# Altium schematic sheet Pic32.SchDoc
size A
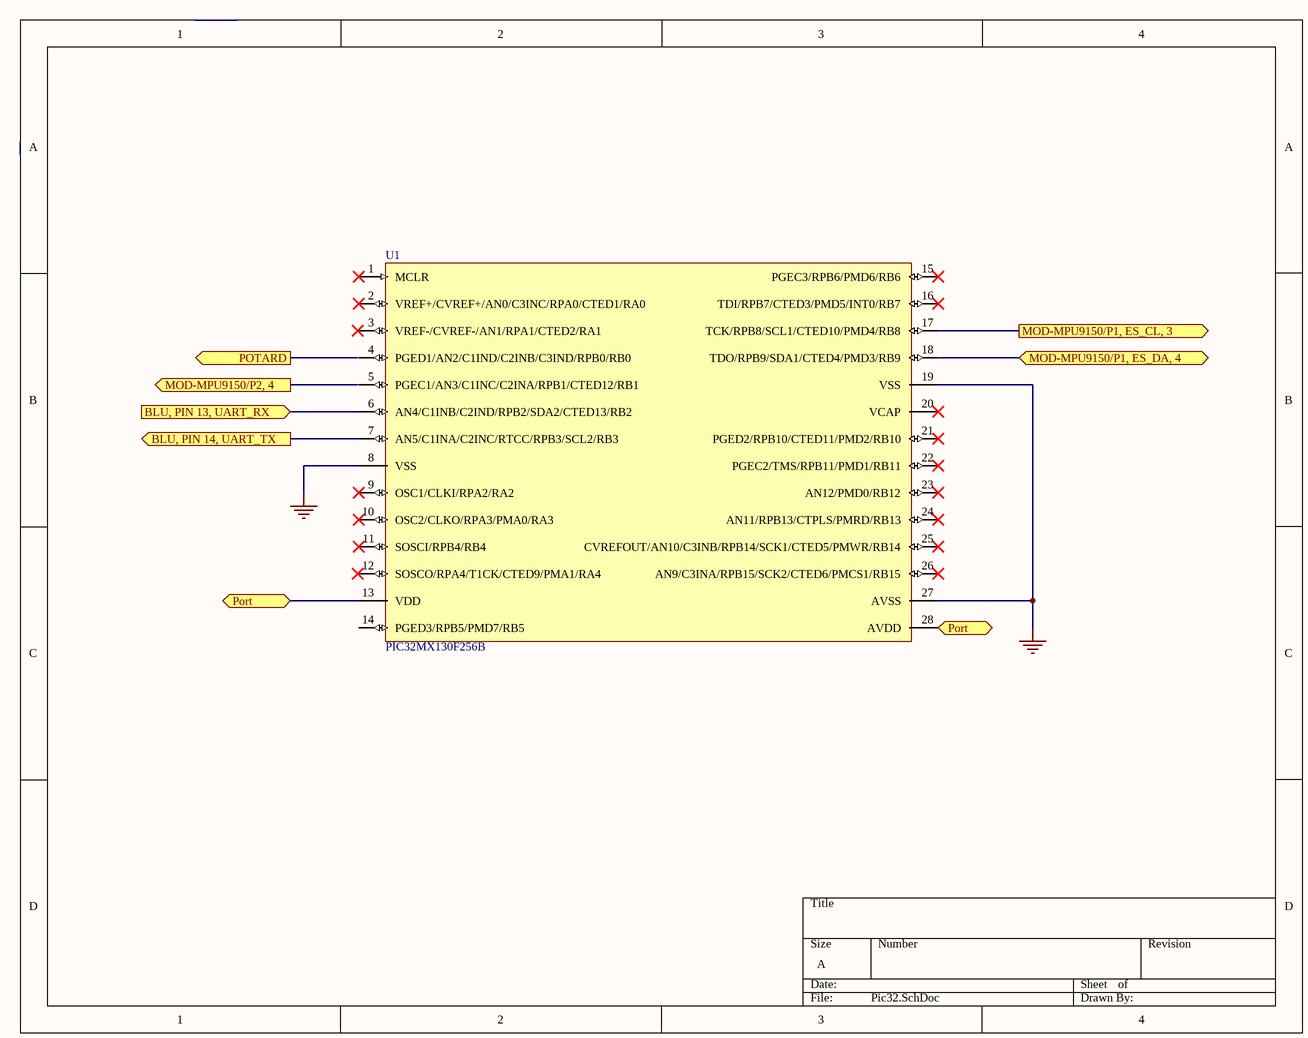
[diagram p0: Pic32.SchDoc]

## Parts
U1  PIC32MX130F256B

## Ports
BLU, PIN 13, UART_RX (in), BLU, PIN 14, UART_TX (out), MOD-MPU9150/P1, ES_CL, 3 (out), MOD-MPU9150/P1, ES_DA, 4 (bidir), MOD-MPU9150/P2, 4 (out), Port, POTARD (out)

## Nets
GND: U1.8(VSS) U1.19(VSS) U1.27(AVSS)
BLU, PIN 13, UART_RX: U1.6(AN4/C1INB/C2IND/RPB2/SDA2/CTED13/RB2) ; port BLU, PIN 13, UART_RX
BLU, PIN 14, UART_TX: U1.7(AN5/C1INA/C2INC/RTCC/RPB3/SCL2/RB3) ; port BLU, PIN 14, UART_TX
MOD-MPU9150/P1, ES_CL, 3: U1.17(TCK/RPB8/SCL1/CTED10/PMD4/RB8) ; port MOD-MPU9150/P1, ES_CL, 3
MOD-MPU9150/P1, ES_DA, 4: U1.18(TDO/RPB9/SDA1/CTED4/PMD3/RB9) ; port MOD-MPU9150/P1, ES_DA, 4
Port: U1.13(VDD) U1.28(AVDD) ; port Port

Not connected (* = marked no-connect by the designer): U1 1(MCLR)* 2(VREF+/CVREF+/AN0/C3INC/RPA0/CTED1/RA0)* 3(VREF-/CVREF-/AN1/RPA1/CTED2/RA1) 4(PGED1/AN2/C1IND/C2INB/C3IND/RPB0/RB0) 5(PGEC1/AN3/C1INC/C2INA/RPB1/CTED12/RB1) 9(OSC1/CLKI/RPA2/RA2)* 10(OSC2/CLKO/RPA3/PMA0/RA3)* 11(SOSCI/RPB4/RB4)* 12(SOSCO/RPA4/T1CK/CTED9/PMA1/RA4) 14(PGED3/RPB5/PMD7/RB5) 15(PGEC3/RPB6/PMD6/RB6)* 16(TDI/RPB7/CTED3/PMD5/INT0/RB7)* 20(VCAP)* 21(PGED2/RPB10/CTED11/PMD2/RB10)* 22(PGEC2/TMS/RPB11/PMD1/RB11)* 23(AN12/PMD0/RB12)* 24(AN11/RPB13/CTPLS/PMRD/RB13)* 25(CVREFOUT/AN10/C3INB/RPB14/SCK1/CTED5/PMWR/RB14)* 26(AN9/C3INA/RPB15/SCK2/CTED6/PMCS1/RB15)*